# EAGLE schematic bubbledisplaybackpack.v01 (EAGLE 6.6.0)
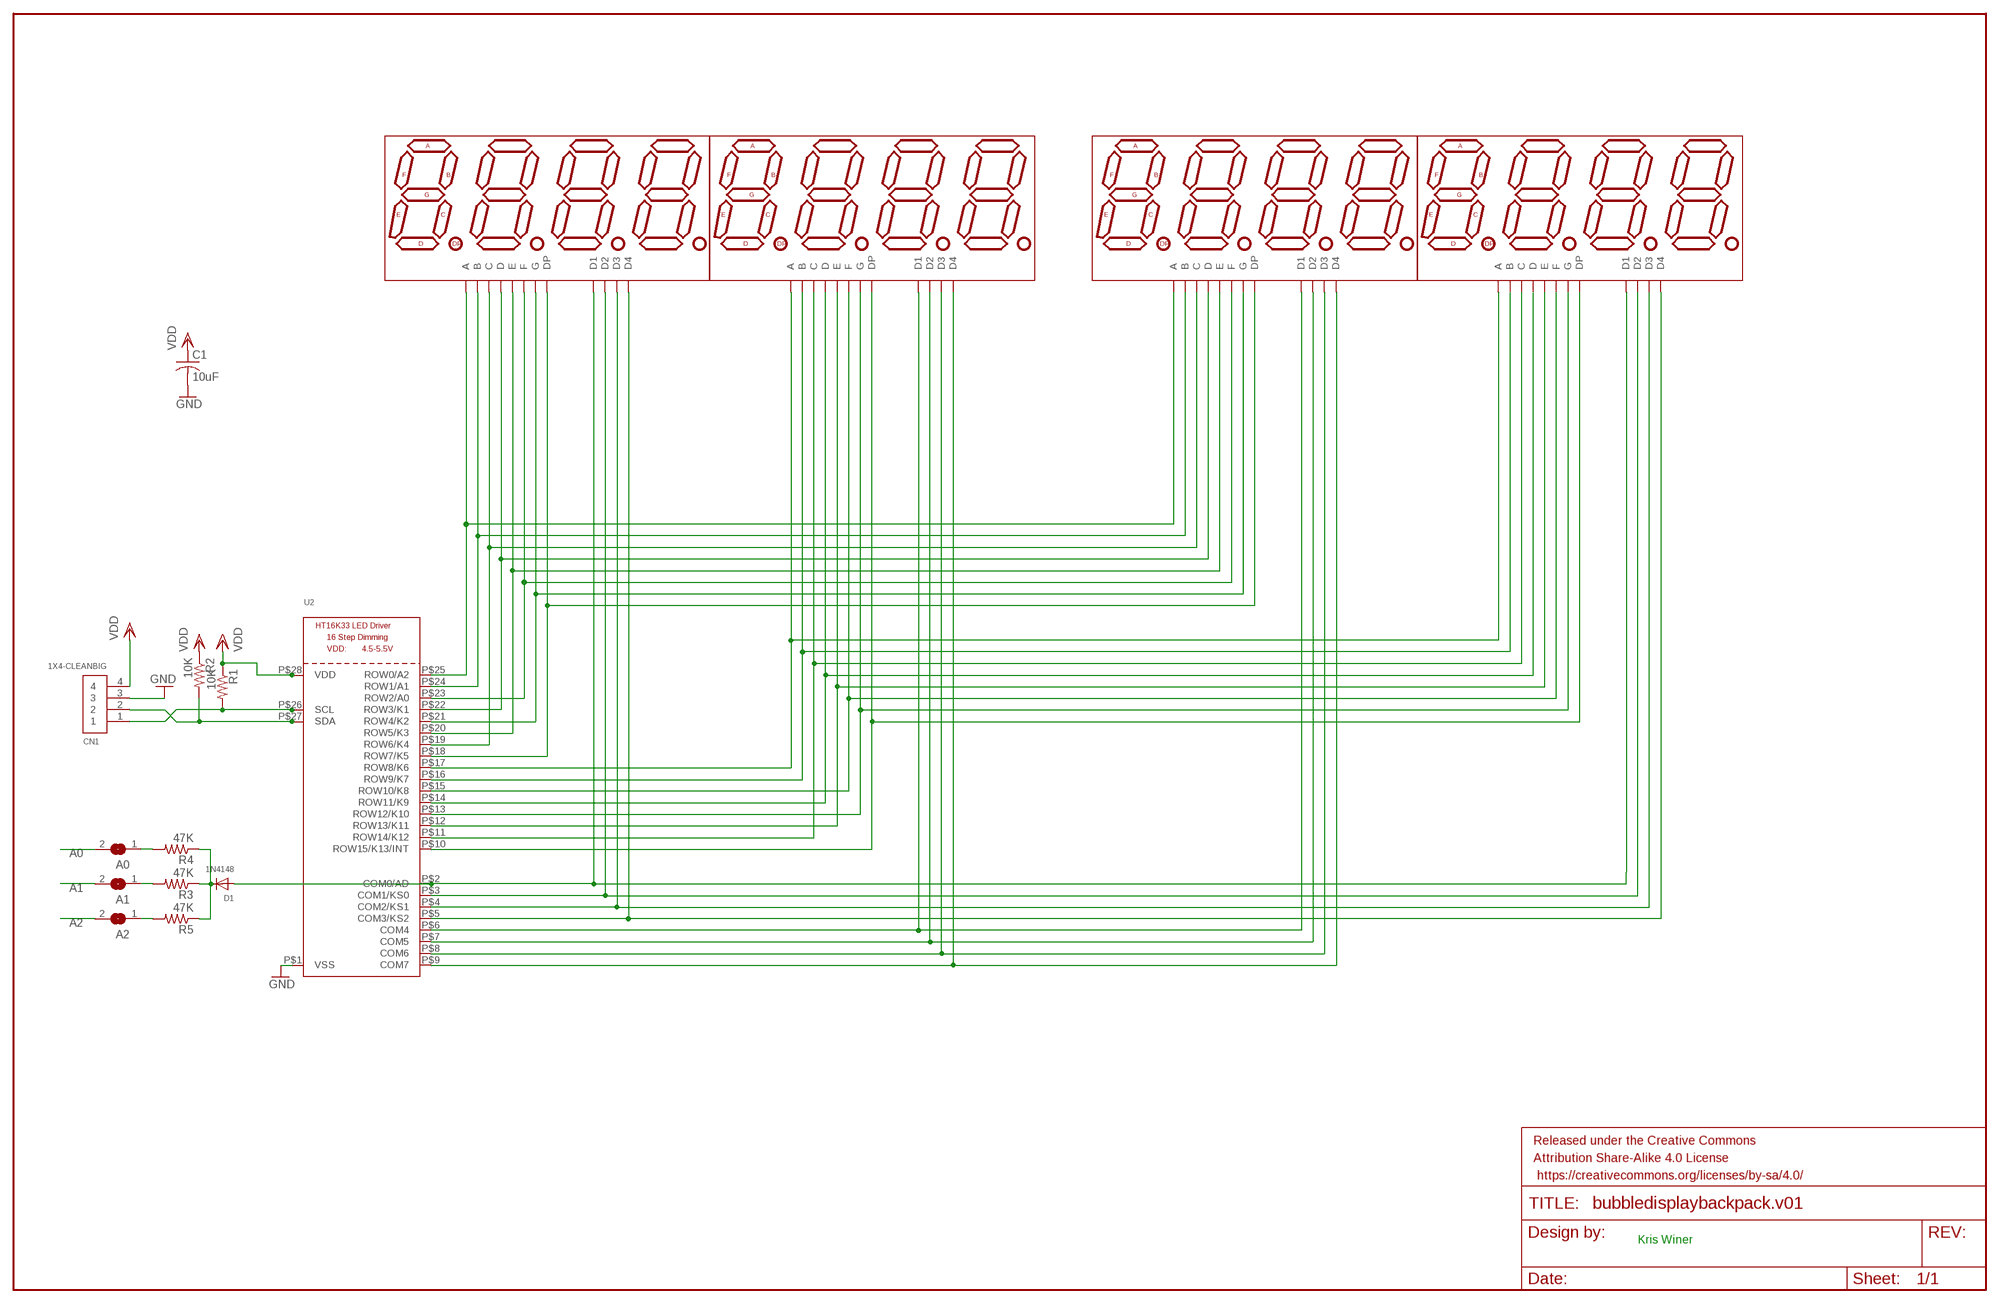
[diagram p0: schematic, sheet 1]

## Parts
A0  SOLDERJUMPERREFLOW_NOPASTE  [SOLDERJUMPER_REFLOW_NOPASTE]
A1  SOLDERJUMPERREFLOW_NOPASTE  [SOLDERJUMPER_REFLOW_NOPASTE]
A2  SOLDERJUMPERREFLOW_NOPASTE  [SOLDERJUMPER_REFLOW_NOPASTE]
C1  10uF  C-USC0805K  [C0805K]
CN1  1X4-CLEANBIG  [1X04-CLEANBIG]
D1  1N4148  DIODESOD-323F  [SOD-323F]
DISPLAY1  hp  7-SEGMENT-4DIGIT-COUNTER-HP-BUBBLE  [DIL12]
DISPLAY2  hp  7-SEGMENT-4DIGIT-COUNTER-HP-BUBBLE  [DIL12]
DISPLAY3  hp  7-SEGMENT-4DIGIT-COUNTER-HP-BUBBLE  [DIL12]
DISPLAY4  hp  7-SEGMENT-4DIGIT-COUNTER-HP-BUBBLE  [DIL12]
FRAME1  FRAME-LEDGER  [CREATIVE_COMMONS]
R1  10K  R-US_R0805  [R0805]
R2  10K  R-US_R0805  [R0805]
R3  47K  R-US_R0805  [R0805]
R4  47K  R-US_R0805  [R0805]
R5  47K  R-US_R0805  [R0805]
U2  HT16K33_SOP28  [SOP28_300MIL]

## Nets
A0: A0.2 DISPLAY1.9(F) DISPLAY3.9(F) U2.P$23(ROW2/A0)
A1: A1.2 DISPLAY1.11(B) DISPLAY3.11(B) U2.P$24(ROW1/A1)
A2: A2.2 DISPLAY1.12(A) DISPLAY3.12(A) U2.P$25(ROW0/A2)
C0P1: D1.A DISPLAY2.1(D1) DISPLAY3.1(D1) U2.P$2(COM0/AD)
C1P10: DISPLAY2.10(D2) DISPLAY3.10(D2) U2.P$3(COM1/KS0)
C2P4: DISPLAY2.4(D3) DISPLAY3.4(D3) U2.P$4(COM2/KS1)
C3P6: DISPLAY2.6(D4) DISPLAY3.6(D4) U2.P$5(COM3/KS2)
C4P1: DISPLAY1.1(D1) DISPLAY4.1(D1) U2.P$6(COM4)
C5P10: DISPLAY1.10(D2) DISPLAY4.10(D2) U2.P$7(COM5)
C6P4: DISPLAY1.4(D3) DISPLAY4.4(D3) U2.P$8(COM6)
C7P6: DISPLAY1.6(D4) DISPLAY4.6(D4) U2.P$9(COM7)
GND: C1.2 CN1.3 U2.P$1(VSS)
N$1: D1.C R3.1 R4.1 R5.1
N$3: DISPLAY1.8(D) DISPLAY3.8(D) U2.P$22(ROW3/K1)
N$5: DISPLAY2.9(F) DISPLAY4.9(F) U2.P$15(ROW10/K8)
N$7: A2.1 R5.2
N$8: DISPLAY2.2(E) DISPLAY4.2(E) U2.P$12(ROW13/K11)
N$19: A1.1 R3.2
N$20: A0.1 R4.2
SCL: CN1.1 R1.2 U2.P$26(SCL)
SDA: CN1.2 R2.2 U2.P$27(SDA)
SEGAD24P12: DISPLAY2.12(A) DISPLAY4.12(A) U2.P$17(ROW8/K6)
SEGBD24P11: DISPLAY2.11(B) DISPLAY4.11(B) U2.P$16(ROW9/K7)
SEGCP3: DISPLAY2.3(C) DISPLAY4.3(C) U2.P$11(ROW14/K12)
SEGD13EP2: DISPLAY1.7(G) DISPLAY3.7(G) U2.P$21(ROW4/K2)
SEGD13GP7: DISPLAY1.3(C) DISPLAY3.3(C) U2.P$19(ROW6/K4)
SEGDD24P8: DISPLAY2.8(D) DISPLAY4.8(D) U2.P$14(ROW11/K9)
SEGDPD13P5: DISPLAY1.5(DP) DISPLAY3.5(DP) U2.P$18(ROW7/K5)
SEGDPP5: DISPLAY2.5(DP) DISPLAY4.5(DP) U2.P$10(ROW15/K13/INT)
SEGED13P2: DISPLAY1.2(E) DISPLAY3.2(E) U2.P$20(ROW5/K3)
SEGFP9: DISPLAY2.7(G) DISPLAY4.7(G) U2.P$13(ROW12/K10)
VDD: C1.1 CN1.4 R1.1 R2.1 U2.P$28(VDD)

## Notes on the sheet
- Kris Winer

## Library data of the parts
A0 A1 A2 = microbuilder:SOLDERJUMPER: SMD Solder JUMPER Solder the two pads together to create a connection, or remove the solder to break it. REFLOW - Use this footprint for solder paste and reflow ovens. WAVE - Use this footprint for hand-soldering (larger pads). CLOSED - Has a trace between the two pads to ensure it is closed by default. The trace needs to be cut to disable the jumper, and can be closed again by creating a solder bridge between the two pads.
C1 = adafruit:C-US: CAPACITOR, American symbol
CN1 = adafruit:1X4: 4-pin connector
D1 = adafruit:DIODE: Diode SMADIODE - SMA Surface Mount Package 20V 1A Schottky Diode Digikey: 641-1014-6-ND DO-1N4148 - Through Hole Small Current Diode SOD-123 20V 1 A (.5mV Vf) Schottky Diode - Digikey: MBRX120TPMSCT-ND SOD-323 10V 570mA (.38mV Vf, 3ns) Schottky Diode - Digikey: ZLLS410CT-ND SOD-523 30V 30mA Schottky Diode (RB751S-40TE61) - Digikey: RB751S-40TE61CT-ND SOT23-R/W - SOT23 Package (R = Solder Paste/Reflow Ovens, W = Hand-Soldering) BAT54Film 40V 300mA - Digikey: 497-7162-1-ND
DISPLAY1-DISPLAY4 = SparkFun-Displays:7-SEGMENT-4DIGIT-COUNTER
FRAME1 = SparkFun-Aesthetics:FRAME-LEDGER: Schematic Frame Standard 11x14 US Ledger frame
R1-R5 = adafruit:R-US_: RESISTOR, American symbol
U2 = microbuilder:HT16K33_SOP28